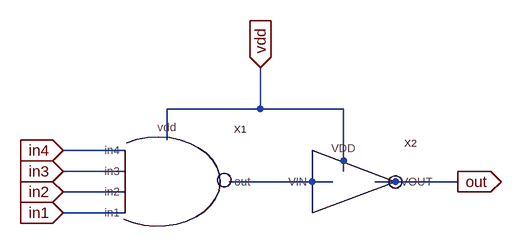
[diagram p0: schematic and4.asc]
and4.asc, the LTspice schematic file:
Version 4
SHEET 1 880 680
WIRE 240 64 240 0
WIRE 240 64 96 64
WIRE 368 64 240 64
WIRE 96 112 96 64
WIRE 32 128 -64 128
WIRE 32 160 -64 160
WIRE 368 160 368 64
WIRE 352 176 192 176
WIRE 544 176 416 176
WIRE 32 192 -64 192
WIRE 32 224 -64 224
FLAG 240 0 vdd
IOPIN 240 0 In
FLAG 544 176 out
IOPIN 544 176 Out
FLAG -64 224 in1
IOPIN -64 224 In
FLAG -64 192 in2
IOPIN -64 192 In
FLAG -64 160 in3
IOPIN -64 160 In
FLAG -64 128 in4
IOPIN -64 128 In
SYMBOL nand4 64 192 R0
SYMATTR InstName X1
SYMBOL inverter 368 176 R0
SYMATTR InstName X2

The netlist it stands for:
* and4.asc
XX1 in1 in2 in3 in4 N001 vdd nand4  ; pins in1 in2 in3 in4 out vdd
XX2 vdd out N001 inverter  ; pins VDD VOUT VIN
.backanno
.end